# Altium schematic sheet BarometricPressureSensor.SchDoc: Barometric Pressure Sensor
size A4; DrawnBy: M. Small & J. Wilson; SheetNumber: 5; SheetTotal: 10
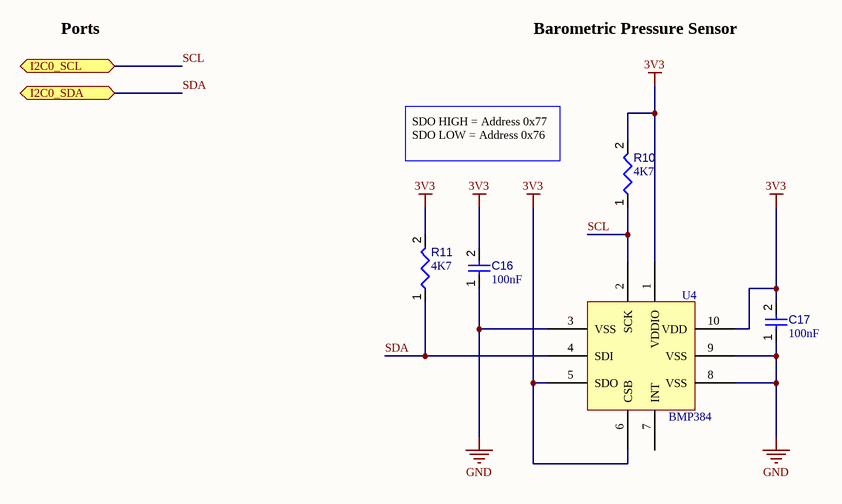
[diagram p0: BarometricPressureSensor.SchDoc]

## Parts
C16  value 100nF  [CAPC0805(2012)145_L]  (hidden comment: Capacitor 100nF +/-20% 25V 0805)
C17  value 100nF  [CAPC0805(2012)145_L]  (hidden comment: Capacitor 100nF +/-20% 25V 0805)
R10  4K7  [RESC0805(2012)_L]
R11  4K7  [RESC0805(2012)_L]
U4  BMP384  [BMP384 LGA 2.0x2.0x0.95mm 10pin]

## Ports
I2C0_SCL (bidir), I2C0_SDA (bidir)

## Nets
3V3: C16.2 C17.2 R10.2 R11.2 U4.1(VDDIO) U4.5(SDO) U4.6(CSB) U4.10(VDD)
GND: C16.1 C17.1 U4.3(VSS) U4.8(VSS) U4.9(VSS)
SCL: R10.1 U4.2(SCK) ; port I2C0_SCL
SDA: R11.1 U4.4(SDI) ; port I2C0_SDA

Not connected (* = marked no-connect by the designer): U4 7(INT)

## Notes on the sheet
- Ports
- Barometric Pressure Sensor
- SDO HIGH = Address 0x77 SDO LOW = Address 0x76
- Date:
- Sheet
- of
- Time:
- Revision:
- Drawn by:
- File:

## Library data of the parts
C16 C17 = CMP-001-00079-2: Chip Capacitor, 100nF +/-20%, 25V, 0805, Thickness 1.45 mm; Tolerance: 10%; Pins: 2; Max Operating Temperature: 85°C; Mounting Technology: SMT; Case/Package: 0805; Voltage Rating: 25V; Min Operating Temperature: -55°C
R10 R11 = CMP-009-00076-1: 4K7 0.125W 5% 0805 (2012 Metric)  SMD; Mounting Technology: SMT; Power: 0.125W; Value: 4K7; Pins: 2; Case/Package: 0805; Tolerance: 5%
U4 = BMP384 Barometric Pressure Sensor: Bosch BMP384 Barometric Pressure Sensor